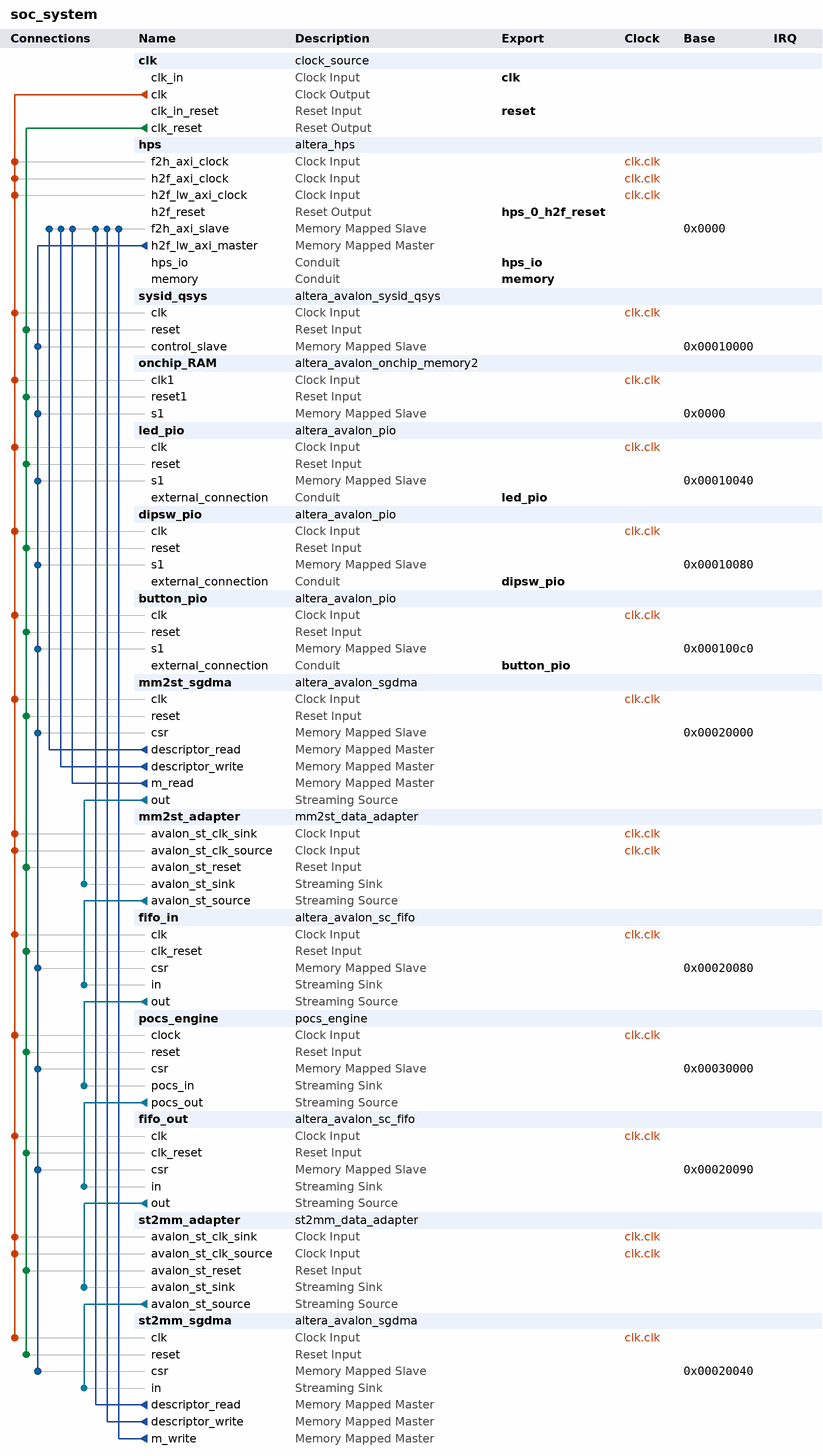
[diagram p0: system contents]
# Platform Designer (Qsys) system soc_system, Cyclone V 5CSEMA5F31C6
# Parameters at their usual value, and those the tool derives, are not listed.
package require -exact qsys 17.1
create_system soc_system
set_project_property DEVICE_FAMILY {Cyclone V}
set_project_property DEVICE 5CSEMA5F31C6

add_instance clk clock_source 17.1
set_instance_parameter_value clk clockFrequency 100000000

add_instance hps altera_hps 17.1
set_instance_parameter_value hps EMAC1_Mode RGMII
set_instance_parameter_value hps EMAC1_PinMuxing {HPS I/O Set 0}
set_instance_parameter_value hps F2SCLK_COLDRST_Enable false
set_instance_parameter_value hps F2SCLK_DBGRST_Enable false
set_instance_parameter_value hps F2SCLK_WARMRST_Enable false
set_instance_parameter_value hps F2SINTERRUPT_Enable false
set_instance_parameter_value hps F2S_Width 2
set_instance_parameter_value hps FPGA_PERIPHERAL_OUTPUT_CLOCK_FREQ_EMAC0_GTX_CLK 100
set_instance_parameter_value hps FPGA_PERIPHERAL_OUTPUT_CLOCK_FREQ_EMAC0_MD_CLK 100.0
set_instance_parameter_value hps FPGA_PERIPHERAL_OUTPUT_CLOCK_FREQ_EMAC1_GTX_CLK 100
set_instance_parameter_value hps FPGA_PERIPHERAL_OUTPUT_CLOCK_FREQ_EMAC1_MD_CLK 100.0
set_instance_parameter_value hps HPS_PROTOCOL DDR3
set_instance_parameter_value hps I2C0_Mode I2C
set_instance_parameter_value hps I2C0_PinMuxing {HPS I/O Set 0}
set_instance_parameter_value hps I2C1_Mode I2C
set_instance_parameter_value hps I2C1_PinMuxing {HPS I/O Set 0}
set_instance_parameter_value hps LWH2F_Enable true
set_instance_parameter_value hps MEM_BANKADDR_WIDTH 3
set_instance_parameter_value hps MEM_CLK_FREQ 400.0
set_instance_parameter_value hps MEM_COL_ADDR_WIDTH 10
set_instance_parameter_value hps MEM_DQ_WIDTH 32
set_instance_parameter_value hps MEM_DRV_STR RZQ/6
set_instance_parameter_value hps MEM_ROW_ADDR_WIDTH 15
set_instance_parameter_value hps MEM_RTT_NOM RZQ/6
set_instance_parameter_value hps MEM_RTT_WR {Dynamic ODT off}
set_instance_parameter_value hps MEM_TCL 7
set_instance_parameter_value hps MEM_TFAW_NS 45.0
set_instance_parameter_value hps MEM_TRAS_NS 36.0
set_instance_parameter_value hps MEM_TRCD_NS 13.125
set_instance_parameter_value hps MEM_TRFC_NS 300.0
set_instance_parameter_value hps MEM_TRP_NS 13.125
set_instance_parameter_value hps MEM_VENDOR Micron
set_instance_parameter_value hps MEM_WTCL 7
set_instance_parameter_value hps QSPI_Mode {1 SS}
set_instance_parameter_value hps QSPI_PinMuxing {HPS I/O Set 0}
set_instance_parameter_value hps REF_CLK_FREQ 25.0
set_instance_parameter_value hps S2FCLK_USER2CLK 5
set_instance_parameter_value hps S2F_Width 2
set_instance_parameter_value hps SDIO_Mode {4-bit Data}
set_instance_parameter_value hps SDIO_PinMuxing {HPS I/O Set 0}
set_instance_parameter_value hps SPIM1_Mode {Single Slave Select}
set_instance_parameter_value hps SPIM1_PinMuxing {HPS I/O Set 0}
set_instance_parameter_value hps STM_Enable false
set_instance_parameter_value hps TIMING_BOARD_AC_SKEW 0.02
set_instance_parameter_value hps TIMING_BOARD_AC_TO_CK_SKEW 0.01
set_instance_parameter_value hps TIMING_BOARD_DQ_TO_DQS_SKEW 0.05
set_instance_parameter_value hps TIMING_BOARD_MAX_CK_DELAY 0.03
set_instance_parameter_value hps TIMING_BOARD_MAX_DQS_DELAY 0.02
set_instance_parameter_value hps TIMING_BOARD_SKEW_BETWEEN_DQS 0.06
set_instance_parameter_value hps TIMING_BOARD_SKEW_CKDQS_DIMM_MAX 0.12
set_instance_parameter_value hps TIMING_BOARD_SKEW_CKDQS_DIMM_MIN 0.06
set_instance_parameter_value hps TIMING_BOARD_SKEW_WITHIN_DQS 0.01
set_instance_parameter_value hps TIMING_TDH 65
set_instance_parameter_value hps TIMING_TDQSCK 255
set_instance_parameter_value hps TIMING_TDQSQ 125
set_instance_parameter_value hps TIMING_TDS 30
set_instance_parameter_value hps TIMING_TIH 140
set_instance_parameter_value hps TIMING_TIS 190
set_instance_parameter_value hps TIMING_TQSH 0.4
set_instance_parameter_value hps UART0_Mode {No Flow Control}
set_instance_parameter_value hps UART0_PinMuxing {HPS I/O Set 0}
set_instance_parameter_value hps USB1_Mode SDR
set_instance_parameter_value hps USB1_PinMuxing {HPS I/O Set 0}
set_instance_parameter_value hps desired_cfg_clk_mhz 100.0
set_instance_parameter_value hps desired_qspi_clk_mhz 400.0
set_instance_parameter_value hps use_default_mpu_clk false

add_instance sysid_qsys altera_avalon_sysid_qsys 17.1
set_instance_parameter_value sysid_qsys id -1395322110

add_instance onchip_RAM altera_avalon_onchip_memory2 17.1
set_instance_parameter_value onchip_RAM dataWidth 32
set_instance_parameter_value onchip_RAM dualPort false
set_instance_parameter_value onchip_RAM initMemContent true
set_instance_parameter_value onchip_RAM initializationFileName onchip_mem.hex
set_instance_parameter_value onchip_RAM memorySize 65536

add_instance led_pio altera_avalon_pio 17.1
set_instance_parameter_value led_pio direction Output
set_instance_parameter_value led_pio width 10

add_instance dipsw_pio altera_avalon_pio 17.1
set_instance_parameter_value dipsw_pio direction Input
set_instance_parameter_value dipsw_pio simDoTestBenchWiring true
set_instance_parameter_value dipsw_pio width 10

add_instance button_pio altera_avalon_pio 17.1
set_instance_parameter_value button_pio direction Input
set_instance_parameter_value button_pio edgeType FALLING
set_instance_parameter_value button_pio simDoTestBenchWiring true
set_instance_parameter_value button_pio width 4

add_instance mm2st_sgdma altera_avalon_sgdma 17.1
set_instance_parameter_value mm2st_sgdma enableBurstTransfers false
set_instance_parameter_value mm2st_sgdma enableUnalignedTransfers false
set_instance_parameter_value mm2st_sgdma readBlockDataWidth 16
set_instance_parameter_value mm2st_sgdma sinkErrorWidth 0
set_instance_parameter_value mm2st_sgdma sourceErrorWidth 0
set_instance_parameter_value mm2st_sgdma transferMode MEMORY_TO_STREAM
set_instance_parameter_value mm2st_sgdma writeBurstcountWidth 4

add_instance mm2st_adapter mm2st_data_adapter 2.0

add_instance fifo_in altera_avalon_sc_fifo 17.1
set_instance_parameter_value fifo_in BITS_PER_SYMBOL 16
set_instance_parameter_value fifo_in CHANNEL_WIDTH 0
set_instance_parameter_value fifo_in ERROR_WIDTH 0
set_instance_parameter_value fifo_in FIFO_DEPTH 16
set_instance_parameter_value fifo_in USE_FILL_LEVEL 1
set_instance_parameter_value fifo_in USE_MEMORY_BLOCKS 1
set_instance_parameter_value fifo_in USE_STORE_FORWARD 0

add_instance pocs_engine pocs_engine 2.0
set_instance_parameter_value pocs_engine FIR_TAPS_NUM 63
set_instance_parameter_value pocs_engine MAX_ITER_NUM 5
set_instance_parameter_value pocs_engine MAX_LVLS_NUM 32
set_instance_parameter_value pocs_engine MAX_SAMPLES_IN_RAM 63

add_instance fifo_out altera_avalon_sc_fifo 17.1
set_instance_parameter_value fifo_out BITS_PER_SYMBOL 16
set_instance_parameter_value fifo_out CHANNEL_WIDTH 0
set_instance_parameter_value fifo_out ERROR_WIDTH 0
set_instance_parameter_value fifo_out FIFO_DEPTH 128
set_instance_parameter_value fifo_out USE_FILL_LEVEL 1
set_instance_parameter_value fifo_out USE_MEMORY_BLOCKS 1
set_instance_parameter_value fifo_out USE_STORE_FORWARD 0

add_instance st2mm_adapter st2mm_data_adapter 2.0

add_instance st2mm_sgdma altera_avalon_sgdma 17.1
set_instance_parameter_value st2mm_sgdma enableBurstTransfers false
set_instance_parameter_value st2mm_sgdma enableUnalignedTransfers false
set_instance_parameter_value st2mm_sgdma readBlockDataWidth 16
set_instance_parameter_value st2mm_sgdma sinkErrorWidth 0
set_instance_parameter_value st2mm_sgdma sourceErrorWidth 0
set_instance_parameter_value st2mm_sgdma transferMode STREAM_TO_MEMORY
set_instance_parameter_value st2mm_sgdma writeBurstcountWidth 4

# connections
add_connection clk.clk button_pio.clk clock
add_connection clk.clk dipsw_pio.clk clock
add_connection clk.clk fifo_in.clk clock
add_connection clk.clk fifo_out.clk clock
add_connection clk.clk hps.f2h_axi_clock clock
add_connection clk.clk hps.h2f_axi_clock clock
add_connection clk.clk hps.h2f_lw_axi_clock clock
add_connection clk.clk led_pio.clk clock
add_connection clk.clk mm2st_adapter.avalon_st_clk_sink clock
add_connection clk.clk mm2st_adapter.avalon_st_clk_source clock
add_connection clk.clk mm2st_sgdma.clk clock
add_connection clk.clk onchip_RAM.clk1 clock
add_connection clk.clk pocs_engine.clock clock
add_connection clk.clk st2mm_adapter.avalon_st_clk_sink clock
add_connection clk.clk st2mm_adapter.avalon_st_clk_source clock
add_connection clk.clk st2mm_sgdma.clk clock
add_connection clk.clk sysid_qsys.clk clock
add_connection clk.clk_reset button_pio.reset reset
add_connection clk.clk_reset dipsw_pio.reset reset
add_connection clk.clk_reset fifo_in.clk_reset reset
add_connection clk.clk_reset fifo_out.clk_reset reset
add_connection clk.clk_reset led_pio.reset reset
add_connection clk.clk_reset mm2st_adapter.avalon_st_reset reset
add_connection clk.clk_reset mm2st_sgdma.reset reset
add_connection clk.clk_reset onchip_RAM.reset1 reset
add_connection clk.clk_reset pocs_engine.reset reset
add_connection clk.clk_reset st2mm_adapter.avalon_st_reset reset
add_connection clk.clk_reset st2mm_sgdma.reset reset
add_connection clk.clk_reset sysid_qsys.reset reset
add_connection hps.h2f_lw_axi_master button_pio.s1 avalon
set_connection_parameter_value hps.h2f_lw_axi_master/button_pio.s1 baseAddress 0x000100c0
add_connection hps.h2f_lw_axi_master dipsw_pio.s1 avalon
set_connection_parameter_value hps.h2f_lw_axi_master/dipsw_pio.s1 baseAddress 0x00010080
add_connection hps.h2f_lw_axi_master fifo_in.csr avalon
set_connection_parameter_value hps.h2f_lw_axi_master/fifo_in.csr baseAddress 0x00020080
add_connection hps.h2f_lw_axi_master fifo_out.csr avalon
set_connection_parameter_value hps.h2f_lw_axi_master/fifo_out.csr baseAddress 0x00020090
add_connection hps.h2f_lw_axi_master led_pio.s1 avalon
set_connection_parameter_value hps.h2f_lw_axi_master/led_pio.s1 baseAddress 0x00010040
add_connection hps.h2f_lw_axi_master mm2st_sgdma.csr avalon
set_connection_parameter_value hps.h2f_lw_axi_master/mm2st_sgdma.csr baseAddress 0x00020000
add_connection hps.h2f_lw_axi_master onchip_RAM.s1 avalon
set_connection_parameter_value hps.h2f_lw_axi_master/onchip_RAM.s1 baseAddress 0x0000
add_connection hps.h2f_lw_axi_master pocs_engine.csr avalon
set_connection_parameter_value hps.h2f_lw_axi_master/pocs_engine.csr baseAddress 0x00030000
add_connection hps.h2f_lw_axi_master st2mm_sgdma.csr avalon
set_connection_parameter_value hps.h2f_lw_axi_master/st2mm_sgdma.csr baseAddress 0x00020040
add_connection hps.h2f_lw_axi_master sysid_qsys.control_slave avalon
set_connection_parameter_value hps.h2f_lw_axi_master/sysid_qsys.control_slave baseAddress 0x00010000
add_connection mm2st_sgdma.descriptor_read hps.f2h_axi_slave avalon
set_connection_parameter_value mm2st_sgdma.descriptor_read/hps.f2h_axi_slave baseAddress 0x0000
add_connection mm2st_sgdma.descriptor_write hps.f2h_axi_slave avalon
set_connection_parameter_value mm2st_sgdma.descriptor_write/hps.f2h_axi_slave baseAddress 0x0000
add_connection mm2st_sgdma.m_read hps.f2h_axi_slave avalon
set_connection_parameter_value mm2st_sgdma.m_read/hps.f2h_axi_slave baseAddress 0x0000
add_connection st2mm_sgdma.descriptor_read hps.f2h_axi_slave avalon
set_connection_parameter_value st2mm_sgdma.descriptor_read/hps.f2h_axi_slave baseAddress 0x0000
add_connection st2mm_sgdma.descriptor_write hps.f2h_axi_slave avalon
set_connection_parameter_value st2mm_sgdma.descriptor_write/hps.f2h_axi_slave baseAddress 0x0000
add_connection st2mm_sgdma.m_write hps.f2h_axi_slave avalon
set_connection_parameter_value st2mm_sgdma.m_write/hps.f2h_axi_slave baseAddress 0x0000
add_connection fifo_in.out pocs_engine.pocs_in avalon_streaming
add_connection fifo_out.out st2mm_adapter.avalon_st_sink avalon_streaming
add_connection mm2st_adapter.avalon_st_source fifo_in.in avalon_streaming
add_connection mm2st_sgdma.out mm2st_adapter.avalon_st_sink avalon_streaming
add_connection pocs_engine.pocs_out fifo_out.in avalon_streaming
add_connection st2mm_adapter.avalon_st_source st2mm_sgdma.in avalon_streaming

# exported interfaces
add_interface button_pio conduit end
set_interface_property button_pio EXPORT_OF button_pio.external_connection
add_interface clk clock sink
set_interface_property clk EXPORT_OF clk.clk_in
add_interface dipsw_pio conduit end
set_interface_property dipsw_pio EXPORT_OF dipsw_pio.external_connection
add_interface hps_0_h2f_reset reset source
set_interface_property hps_0_h2f_reset EXPORT_OF hps.h2f_reset
add_interface hps_io conduit end
set_interface_property hps_io EXPORT_OF hps.hps_io
add_interface led_pio conduit end
set_interface_property led_pio EXPORT_OF led_pio.external_connection
add_interface memory conduit end
set_interface_property memory EXPORT_OF hps.memory
add_interface reset reset sink
set_interface_property reset EXPORT_OF clk.clk_in_reset

set_interconnect_requirement {$system} qsys_mm.clockCrossingAdapter HANDSHAKE
set_interconnect_requirement {$system} qsys_mm.insertDefaultSlave FALSE
set_interconnect_requirement {$system} qsys_mm.maxAdditionalLatency 1
set_interconnect_requirement hps.f2h_sdram0_data qsys_mm.secureAddressRanges {}
set_interconnect_requirement hps.f2h_sdram0_data qsys_mm.security NON_SECURE
set_interconnect_requirement hps_only_master.master qsys_mm.security SECURE
set_interconnect_requirement mm2st_sgdma.descriptor_read qsys_mm.security NON_SECURE
set_interconnect_requirement mm2st_sgdma.descriptor_write qsys_mm.security NON_SECURE
set_interconnect_requirement mm2st_sgdma.m_read qsys_mm.security NON_SECURE
set_interconnect_requirement st2mm_sgdma.descriptor_read qsys_mm.security NON_SECURE
set_interconnect_requirement st2mm_sgdma.descriptor_write qsys_mm.security NON_SECURE
set_interconnect_requirement st2mm_sgdma.m_write qsys_mm.security NON_SECURE

save_system soc_system.qsys
